# EAGLE design PIEFoundry 32-channel EIB (EAGLE 9.6.2)
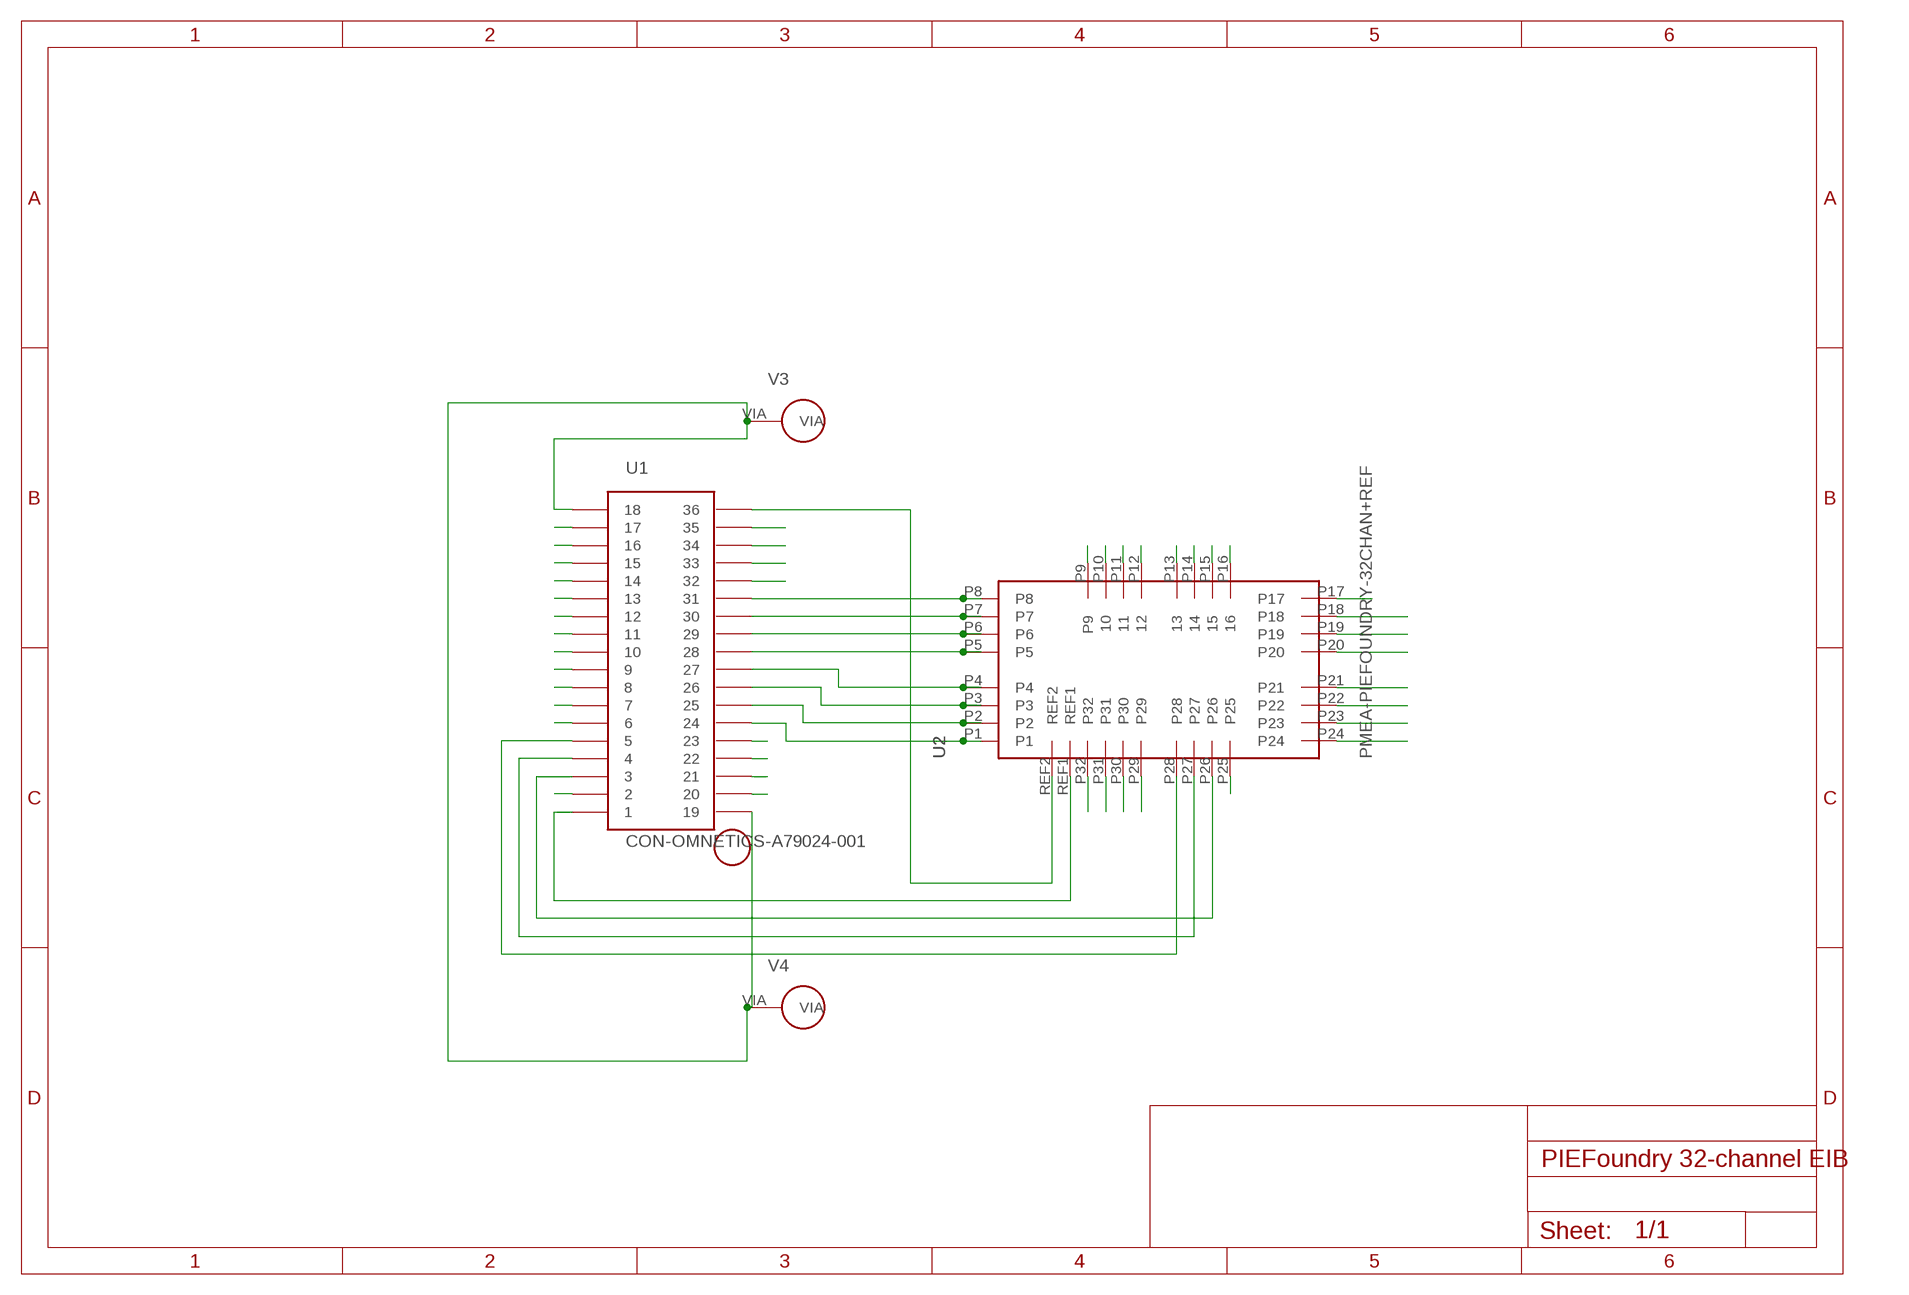
[diagram p0: schematic, sheet 1]

## Parts
U1  CON-OMNETICS-A79024-001  [CON-OMNETICS-A79024-001]
U2  PMEA-PIEFOUNDRY-32CHAN+REF  [PMEA-PIEFOUNDRY-32CHAN+REF]
V3  SOLDER_VIA_500_UM  [SOLDER_VIA_500_UM]
V4  SOLDER_VIA_500_UM  [SOLDER_VIA_500_UM]

## Nets
GND: U1.18 U1.19 V3.VIA V4.VIA
P1: U1.24 U2.P1
P2: U1.25 U2.P2
P3: U1.26 U2.P3
P4: U1.27 U2.P4
P5: U1.28 U2.P5
P6: U1.29 U2.P6
P7: U1.30 U2.P7
P8: U1.31 U2.P8
P9: U1.20 U2.P9
P10: U1.21 U2.P10
P11: U1.22 U2.P11
P12: U1.23 U2.P12
P13: U1.32 U2.P13
P14: U1.33 U2.P14
P15: U1.34 U2.P15
P16: U1.35 U2.P16
P17: U1.6 U2.P17
P18: U1.7 U2.P18
P19: U1.8 U2.P19
P20: U1.9 U2.P20
P21: U1.10 U2.P21
P22: U1.11 U2.P22
P23: U1.12 U2.P23
P24: U1.13 U2.P24
P25: U1.2 U2.P25
P26: U1.3 U2.P26
P27: U1.4 U2.P27
P28: U1.5 U2.P28
P29: U1.14 U2.P29
P30: U1.15 U2.P30
P31: U1.16 U2.P31
P32: U1.17 U2.P32
P33: U1.1 U2.REF1
P34: U1.36 U2.REF2

## Library data of the parts
U1 = con-omnetics:CON-OMNETICS-A79024-001: 36 Position Dual Row Male Nano-Miniature (.025″/.64mm) Connector; Featuring 4 Guide Posts and Horizontal Surface Mount Tails
U2 = pmea-piefoundry:PMEA-PIEFOUNDRY-32CHAN+REF: 32 channel polymer microelectrode array (pMEA) connector with integrated reference; Connection requires 34 wirebond (soft-gold) pads for ultrasonic bump bonding 3/25/25 Kee Scholten PIE Foundry @ USC
V3 V4 = VIA Connectors:SOLDER_VIA_500_UM: 500 um ID via for soldering leads

## Board
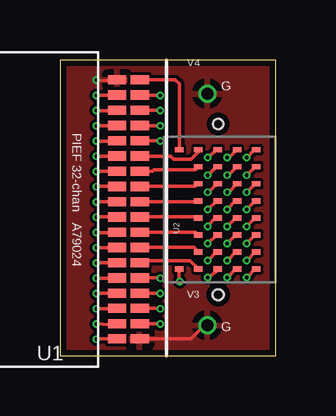
[diagram p1: board, top side]
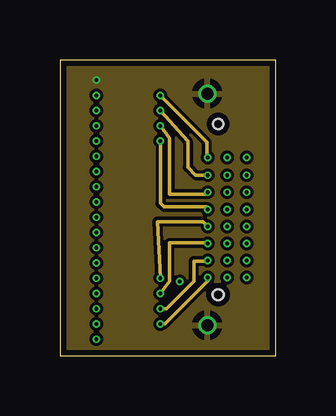
[diagram p2: board, inner layer Route2]
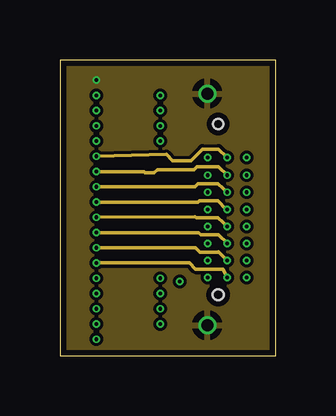
[diagram p3: board, inner layer Route15]
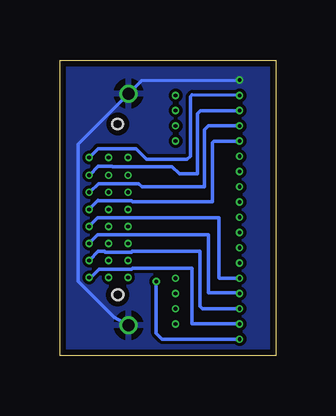
[diagram p4: board, bottom side, seen from below]

Size 9.02 x 12.32 mm. Coordinates in mm from the lower left corner, seen from the top.
Outline: 0,0 9.02,0 9.02,12.32 0,12.32 0,0
Copper layers (1+2*15+16): Top 0.035mm / dielectric 1.5mm / Route2 0.035mm / dielectric 0.15mm / Route15 0.035mm / dielectric 0.2mm / Bottom 0.035mm
Design rules "PIEF-4-1-23 design rules *": minimum track width 6mil, minimum drill 6mil, track to track 5mil, track to pad 5mil, pad to pad 5mil, via to via 5mil, smd to smd 5mil, copper to edge 10mil, drill to drill 15mil, minimum pad ring 3mil, minimum via ring 3mil, stop-mask expansion 4mil, vias tented up to drill 14mil, thermal gap 10mil
Holes 0.46 mm at 6.6,2.54
Holes 0.44 mm at 6.6,9.65

### Footprints (pad centres in the part's own frame; a part is rotated, then mirrored left to right if it is on the bottom)
CON-OMNETICS-A79024-001 = smd 0.762 x 0.381: 1 1.88,-5.397; 2 1.88,-4.763; 3 1.88,-4.128; 4 1.88,-3.493; 5 1.88,-2.857; 6 1.88,-2.223; 7 1.88,-1.587; 8 1.88,-0.953; 9 1.88,-0.318; 10 1.88,0.318; 11 1.88,0.953; 12 1.88,1.587; 13 1.88,2.223; 14 1.88,2.857; 15 1.88,3.493; 16 1.88,4.128; 17 1.88,4.763; 18 1.88,5.397; 19 2.819,-5.397; 20 2.819,-4.763; 21 2.819,-4.128; 22 2.819,-3.493; 23 2.819,-2.857; 24 2.819,-2.223; 25 2.819,-1.587; 26 2.819,-0.953; 27 2.819,-0.318; 28 2.819,0.318; 29 2.819,0.953; 30 2.819,1.587; 31 2.819,2.223; 32 2.819,2.857; 33 2.819,3.493; 34 2.819,4.128; 35 2.819,4.763; 36 2.819,5.397
PMEA-PIEFOUNDRY-32CHAN+REF = smd 0.225 x 0.35: P1 -2.485,1.208; P2 -1.775,1.208; P3 -1.065,1.208; P4 -0.355,1.208; P5 0.355,1.208; P6 1.065,1.208; P7 1.775,1.208; P8 2.485,1.208; P9 -2.485,0.403; P10 -1.775,0.403; P11 -1.065,0.403; P12 -0.355,0.403; P13 0.355,0.403; P14 1.065,0.403; P15 1.775,0.403; P16 2.485,0.403; P17 -2.485,-0.403; P18 -1.775,-0.403; P19 -1.065,-0.403; P20 -0.355,-0.403; P21 0.355,-0.403; P22 1.065,-0.403; P23 1.775,-0.403; P24 2.485,-0.403; P25 -2.485,-1.208; P26 -1.775,-1.208; P27 -1.065,-1.208; P28 -0.355,-1.208; P29 0.355,-1.208; P30 1.065,-1.208; P31 1.775,-1.208; P32 2.485,-1.208; REF1 -2.485,2.013; REF2 2.485,2.013
SOLDER_VIA_500_UM = drill 0.5: VIA 0,0

### Placement (x,y rotation side)
U1  0.51,6.1 0 top
U2  6.99,6.1 90 top
V3  6.15,1.27 0 top
V4  6.15,10.92 0 top

### Tracks (layer width: path | path; a pad name or v marks a point on that pad's centre or on a via)
GND  (via drill 0.15)
  Top 0.152: U1.19 5.46,0.7 6.05,1.28 V3.VIA | U1.18 2.29,11.46 v1.52,11.48
  Bottom 0.152: v1.52,11.48 5.61,11.46 V4.VIA 8.25,8.82 8.25,3.1 6.75,1.61 V3.VIA
  pour Top: 0,12.19 0,0 8.89,0 9.02,0.13 9.02,12.06 8.89,12.19
  pour Route2: 0.13,12.19 0.13,0.13 0,0 9.02,0 9.02,12.06 8.89,12.19
  pour Route15: 0,12.32 0,0.13 0.13,0 8.89,0 9.02,0.13 9.02,12.19 8.89,12.32
  pour Bottom: 0,12.19 0,0.13 9.02,0.13 9.02,12.19
P1
  Top 0.152: U1.24 3.41,3.95 5.44,3.95 U2.P1
P2
  Top 0.152: U1.25 5.59,4.51 U2.P2
P3
  Top 0.152: U2.P3 5.67,5.14 U1.26
P4
  Top 0.152: U1.27 5.74,5.78 U2.P4
P5
  Top 0.152: U1.28 5.74,6.41 U2.P5
P6
  Top 0.152: U2.P6 5.67,7.05 U1.29
P7
  Top 0.152: U2.P7 5.65,7.74 4.32,7.74 4.32,7.75 3.94,7.75 3.87,7.68 U1.30
P8
  Top 0.152: U1.31 4.62,8.32 4.77,8.18 5.46,8.18 5.78,8.49 U2.P8
P9  (via drill 0.15)
  Top 0.152: U1.20 4,1.33 v4.19,1.32 | v6.17,3.25 6.58,3.54 U2.P9
  Route2 0.152: v6.17,3.25 6.17,3.11 4.38,1.32 v4.19,1.32
P10  (via drill 0.15)
  Top 0.152: U1.21 4,1.97 v4.19,1.96 | v6.17,3.96 6.53,4.32 U2.P10
  Route2 0.152: v4.19,1.96 4.45,1.96 5.59,3.1 5.59,3.94 6.15,3.94 v6.17,3.96
P11  (via drill 0.15)
  Top 0.152: U1.22 4,2.6 v4.19,2.59 | v6.17,4.67 6.55,5.03 U2.P11
  Route2 0.152: v4.19,2.59 4.57,3.1 4.57,4.7 6.15,4.7 v6.17,4.67
P12  (via drill 0.15)
  Top 0.152: U1.23 4,3.24 v4.19,3.23 | v6.17,5.38 6.17,5.41 6.5,5.74 U2.P12
  Route2 0.152: v4.19,3.23 4.06,5.59 5.97,5.59 v6.17,5.38
P13  (via drill 0.15)
  Top 0.152: U1.32 4.13,8.95 v4.19,8.94 | v6.17,6.1 6.55,6.45 U2.P13
  Route2 0.152: v4.19,8.94 4.19,8.81 4.19,6.35 4.35,6.2 6.13,6.2 v6.17,6.1
P14  (via drill 0.15)
  Top 0.152: U1.33 4.13,9.59 v4.19,9.58 | v6.17,6.81 6.57,7.16 U2.P14
  Route2 0.152: v4.19,9.58 4.57,9.07 4.57,6.73 6.1,6.73 v6.17,6.81
P15  (via drill 0.15)
  Top 0.152: U1.34 4.13,10.22 v4.19,10.21 | v6.17,7.52 6.52,7.87 U2.P15
  Route2 0.152: v4.19,10.21 5.33,8.94 5.33,7.85 5.66,7.52 v6.17,7.52
P16  (via drill 0.15)
  Top 0.152: U1.35 4.13,10.86 v4.19,10.85 | v6.17,8.26 6.52,8.58 U2.P16
  Route2 0.152: v4.19,10.85 4.18,10.85 6.13,8.89 6.13,8.29 v6.17,8.26
P17  (via drill 0.15)
  Top 0.152: U1.6 1.71,3.87 v1.52,3.86 | v6.99,3.25 7.34,3.61 U2.P17
  Route15 0.152: v1.52,3.86 5.41,3.86 5.66,3.61 6.81,3.61 v6.99,3.25
P18  (via drill 0.15)
  Top 0.152: v6.99,3.96 7.34,4.32 U2.P18 | U1.7 2.38,4.5 v1.52,4.5
  Route15 0.152: v1.52,4.5 5.66,4.5 5.84,4.32 6.6,4.32 6.61,4.32 6.62,4.32 v6.99,3.96
P19  (via drill 0.15)
  Top 0.152: v6.99,4.67 7.34,5.03 U2.P19 | U1.8 2.38,5.13 v1.52,5.13
  Route15 0.152: v1.52,5.13 5.79,5.13 5.89,5.03 6.61,5.03 v6.99,4.67
P20  (via drill 0.15)
  Top 0.152: v6.99,5.38 7.34,5.74 U2.P20 | U1.9 1.69,5.78 v1.52,5.77
  Route15 0.152: v1.52,5.77 5.64,5.79 5.69,5.74 6.59,5.74 v6.99,5.38
P21  (via drill 0.15)
  Top 0.152: v6.99,6.1 7.33,6.45 U2.P21 | U1.10 1.69,6.41 v1.52,6.4
  Route15 0.152: v1.52,6.4 5.77,6.4 5.82,6.45 6.02,6.45 6.03,6.45 6.59,6.45 6.94,6.11 v6.99,6.1
P22  (via drill 0.15)
  Top 0.152: v6.99,6.81 7.02,6.79 U2.P22 | U1.11 1.69,7.05 v1.52,7.04
  Route15 0.152: v1.52,7.04 5.64,7.04 5.77,7.16 6.6,7.16 v6.99,6.81
P23  (via drill 0.15)
  Top 0.152: v6.99,7.52 7.05,7.53 U2.P23 | U1.12 1.69,7.68 v1.52,7.67
  Route15 0.152: v1.52,7.67 3.5,7.67 3.56,7.62 3.94,7.62 4.06,7.75 5.59,7.75 5.71,7.87 6.61,7.87 v6.99,7.52
P24  (via drill 0.15)
  Top 0.152: U1.13 1.71,8.32 v1.52,8.31 | v6.99,8.26 7.08,8.27 U2.P24
  Route15 0.152: v1.52,8.31 4.45,8.38 4.7,8.13 5.46,8.13 5.94,8.61 6.62,8.61 6.95,8.28 v6.99,8.26
P25  (via drill 0.15)
  Top 0.152: U1.2 2.32,1.27 v1.52,1.32 | v7.8,3.25 8.16,3.61 U2.P25
  Bottom 0.152: v1.52,1.32 3.5,1.32 3.52,1.33 3.52,3.65 5.99,3.65 6.03,3.61 7.38,3.61 7.74,3.25 v7.8,3.25
P26  (via drill 0.15)
  Top 0.152: U1.3 2.38,1.96 v1.52,1.96 | v7.8,3.96 8.16,4.32 U2.P26
  Bottom 0.152: v1.52,1.96 3.06,1.96 3.17,2.06 3.17,4.34 6,4.34 6.03,4.32 7.13,4.32 7.16,4.34 7.43,4.34 7.79,3.98 v7.8,3.96
P27  (via drill 0.15)
  Top 0.152: U1.4 2.38,2.59 v1.52,2.59 | v7.8,4.67 8.15,5.03 U2.P27
  Bottom 0.152: v1.52,2.59 1.7,2.61 2.82,2.61 2.82,5.03 7.44,5.03 7.77,4.7 v7.8,4.67
P28  (via drill 0.15)
  Top 0.152: U1.5 2.38,3.23 v1.52,3.23 | v7.8,5.38 8.15,5.74 U2.P28
  Bottom 0.152: v1.52,3.23 2.37,3.23 U1.5 2.38,5.74 6.02,5.74 6.03,5.74 7.13,5.74 7.45,5.74 7.79,5.39 v7.8,5.38
P29  (via drill 0.15)
  Top 0.152: U1.14 2.38,8.94 v1.52,8.94 | v7.8,6.1 8.15,6.45 U2.P29
  Bottom 0.152: v1.52,8.94 2.59,8.94 2.66,8.87 2.66,6.41 5.98,6.41 6.03,6.45 6.32,6.45 6.33,6.46 6.83,6.46 6.84,6.45 7.39,6.45 7.41,6.47 | 7.41,6.47 | 7.41,6.47 v7.8,6.1
P30  (via drill 0.15)
  Top 0.152: U1.15 2.38,9.58 v1.52,9.58 | v7.8,6.81 8.15,7.16 U2.P30
  Bottom 0.152: v1.52,9.58 2.81,9.58 2.98,9.4 2.98,7.03 5.59,7.03 5.73,7.17 6.02,7.17 6.03,7.16 7.41,7.16 7.75,6.82 v7.8,6.81
P31  (via drill 0.15)
  Top 0.152: U1.16 2.38,10.21 v1.52,10.21 | v7.8,7.52 8.15,7.87 U2.P31
  Bottom 0.152: v1.52,10.21 3.15,10.21 3.27,10.08 3.27,7.58 3.28,7.57 4.03,7.57 4.33,7.87 6.82,7.87 6.84,7.89 7.41,7.89 7.78,7.53 v7.8,7.52
P32  (via drill 0.15)
  Top 0.152: U1.17 1.68,10.86 v1.52,10.85 | v7.8,8.26 8.12,8.58 U2.P32
  Bottom 0.152: v1.52,10.85 3.5,10.86 3.57,10.79 3.57,8.32 3.71,8.18 5.4,8.18 5.84,8.62 7.43,8.62 v7.8,8.26
P33  (via drill 0.15)
  Top 0.152: U1.1 1.68,0.7 v1.52,0.69 | v5,3.09 4.97,3.11 U2.REF1
  Bottom 0.152: v1.52,0.69 4.75,0.69 5,0.94 v5,3.09
P34
  Top 0.152: U1.36 4.81,11.49 4.98,11.32 U2.REF2

### Text on the board
tPlace: G | PIEF 32-chan A79024 | G
tDocu: C - 0010 v1 | PIEF USC